# EasyEDA schematic DisenhoEsquematicov1.json
TITLE: Prótesis de Pulgar transmetacarpiana; REV: 1.0; Date: 2023-10-16; Sheet: 1/1; Drawn By: Nicolas Arango; Company: UPCH
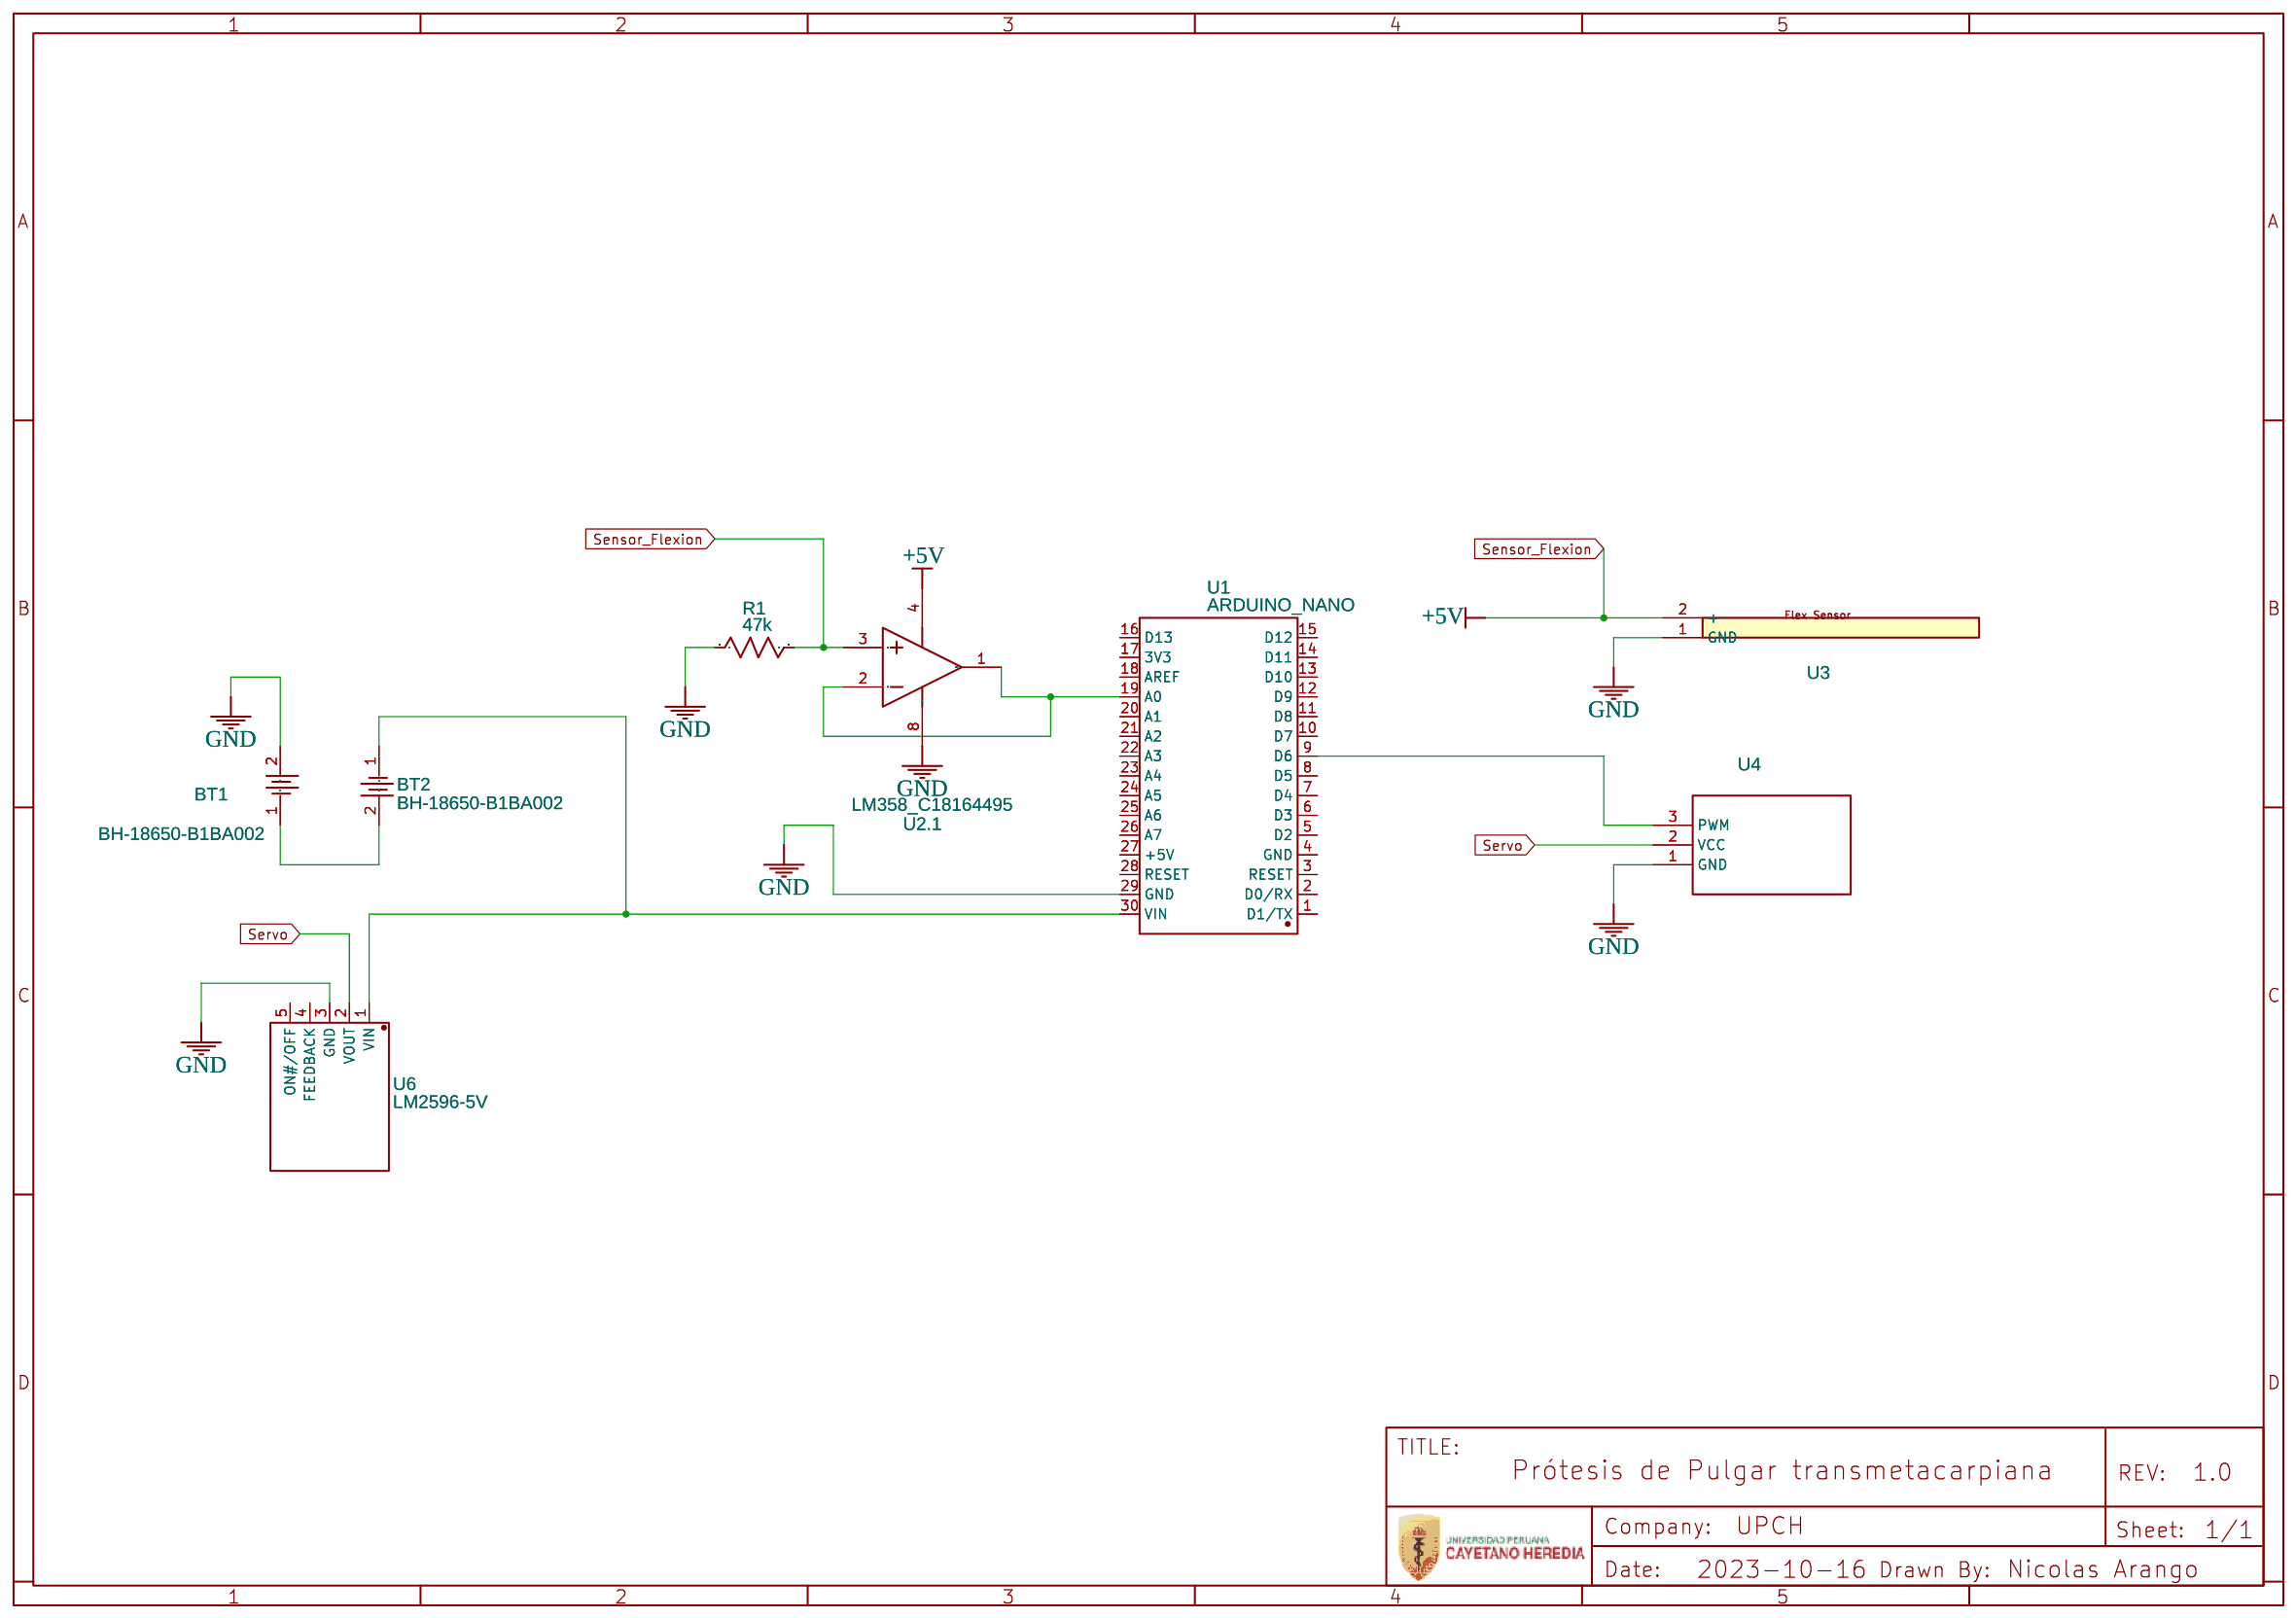
[diagram p0: schematic sheet]

## Parts
BT1  BH-18650-B1BA002  [BATTERY-SMD_18650-1S-L77.1-W20.7-1]
BT2  BH-18650-B1BA002  [BATTERY-SMD_18650-1S-L77.1-W20.7-1]
R1  47k  [R0603]
U1  ARDUINO_NANO  [COMM-TH_ARDUINO_NANO]
U2  LM358_C18164495  [SOIC-8_L4.9-W3.9-P1.27-LS6.0-BL]  (section 1)
U3  NO  [FLEX SENSOR]
U4  NO  [MICRO SERVO SG90]
U6  LM2596-5V  [TO-220-5L_L10.2-W4.5-P1.71-L]

## Library data of the parts
BT1 BT2 = BH-18650-B1BA002: Contributor: lcsc; Supplier: LCSC; Supplier Part: C2988620; Manufacturer: MYOUNG(美阳); JLCPCB Part Class: Extended Part; link: https://lcsc.com/eda_search?q=C2988620&%26type=1&ref=editor
R1 = R_0603_US: Contributor: LCEDA_Lib
U1 = ARDUINO_NANO: Contributor: lcsc; Supplier: LCSC; Supplier Part: C9900017879; Manufacturer: null; JLCPCB Part Class: Extended Part; link: https://lcsc.com/eda_search?q=C9900017879&%26type=1&ref=editor
U2 = LM358_C18164495: Supplier: LCSC; Supplier Part: C18164495; Manufacturer: GR(国睿); Manufacturer Part: LM358; subpart_no: 1; link: https://lcsc.com/eda_search?q=C18164495&%26type=1&ref=editor
U3 = Flex Sensor: Contributor: vaga101; sourceId: YsmgyP7pj
U4 = MICRO SERVO SG90: Contributor: flipi
U6 = LM2596-5V: Contributor: LCSC; Supplier: LCSC; Supplier Part: C192249; Manufacturer: HTC Korea TAEJIN Tech; link: https://lcsc.com/eda_search?q=C192249&%26type=1&ref=editor

## Nets
+5V: R1.2 U2.3(IN A+) U2.4(VEE) U3.2(+)
GND: BT1.2 R1.1 U1.29(GND) U2.8(VCC) U3.1(GND) U4.1(GND) U6.3(GND)
Servo: U4.2(VCC) U6.2(VOUT)
Net-(BT1-1): BT1.1 BT2.2
Net-(BT2-1): BT2.1 U1.30(VIN) U6.1(VIN)
Net-(U1-9): U1.9(D6) U4.3(PWM)
Net-(U1-19): U1.19(A0) U2.1(OUT A) U2.2(IN A-)

Not connected (* = marked no-connect by the designer): U1 1(D1/TX) 2(D0/RX) 3(RESET) 4(GND) 5(D2) 6(D3) 7(D4) 8(D5) 10(D7) 11(D8) 12(D9) 13(D10) 14(D11) 15(D12) 16(D13) 17(3V3) 18(AREF) 20(A1) 21(A2) 22(A3) 23(A4) 24(A5) 25(A6) 26(A7) 27(+5V) 28(RESET); U6 4(FEEDBACK) 5(ON#/OFF)
